# Altium schematic sheet Sheet2.SchDoc
size A4
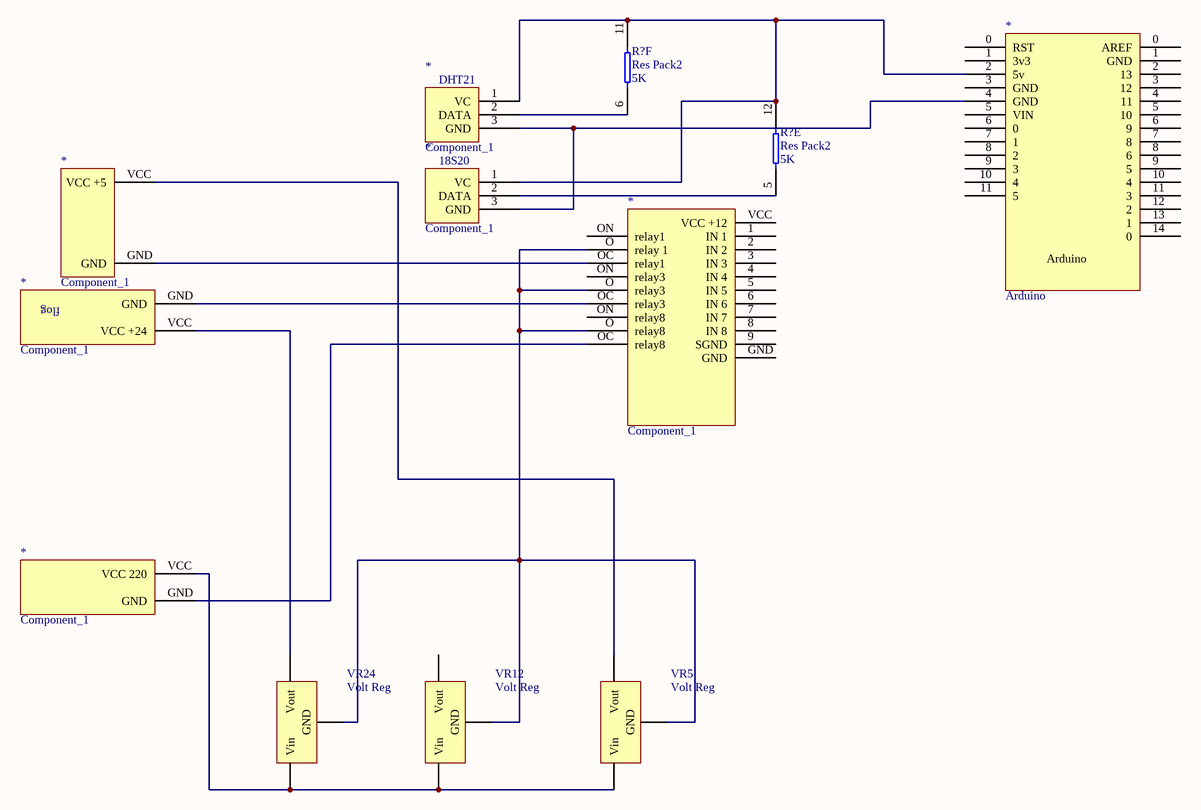
[diagram p0: Sheet2.SchDoc]

## Parts
(Parts that share a designator on the sheet are numbered #1, #2 ... from top to bottom, then left to right.)
*#1  Arduino
*#2  Component_1
*#3  Component_1
*#4  Component_1
*#5  Component_1
*#6  Component_1
*#7  Component_1
R?#1  Res Pack2  value 5K  [DIP-16]  (part F of 8)
R?#2  Res Pack2  value 5K  [DIP-16]  (part E of 8)
VR5  Volt Reg  [D2PAK_N]
VR12  Volt Reg  [D2PAK_N]
VR24  Volt Reg  [D2PAK_N]

## Nets
Net*#1_2: *#1.2(5v) *#2.1(VC) *#7.1(VC) R?#1.11 R?#2.12
Net*#1_4: *#1.4(GND) *#2.3(GND) *#7.3(GND)
Net*#2_2: *#2.2(DATA) R?#2.5
Net*#3_GND: *#3.GND *#5.OC(relay1)
Net*#3_VCC: *#3.VCC(VCC_+5) VR5.3(Vout)
Net*#4_GND: *#4.GND *#5.OC(relay3)
Net*#4_VCC: *#4.VCC(VCC_+24) VR24.3(Vout)
Net*#5_O: *#5.O(relay_1) VR5.2(GND) VR12.2(GND) VR24.2(GND)
Net*#5_OC: *#5.OC(relay8) *#6.GND
Net*#6_VCC: *#6.VCC(VCC_220) VR5.1(Vin) VR12.1(Vin) VR24.1(Vin)
Net*#7_2: *#7.2(DATA) R?#1.6

Not connected (* = marked no-connect by the designer): *#1 0(RST) 1(3v3) 3(GND) 5(VIN) 6(0) 7(1) 8(2) 9(3) 10(4) 11(5) 12(2) 13(1) 14(0); *#5 1(IN_1) 2(IN_2) 3(IN_3) 4(IN_4) 5(IN_5) 6(IN_6) 7(IN_7) 8(IN_8) 9(SGND) GND ON(relay1) VCC(VCC_+12); VR12 3(Vout)

## Notes on the sheet
- (in symbol Component_1) DHT21; 18S20; flog

## Library data of the parts
R?#1 R?#2 = Res Pack2: Isolated Resistor Network - Parts; Sim Note: Enter the Resistance value into parameter field.; Published: 24-Mar-1999; LatestRevisionDate: 17-Jul-2002; LatestRevisionNote: Re-released for DXP Platform.; PackageReference: DIP-16; Publisher: Altium Limited; Code_JEDEC: MO-001-AC
VR5 VR12 VR24 = Volt Reg: Voltage Regulator; Published: 24-Mar-1999; LatestRevisionDate: 29-May-2009; LatestRevisionNote: IPC-7351 Footprint Added.; PackageReference: D2PAK; Publisher: Altium Limited; PackageDescription: 3-Pin Transistor Outline Package 2.54 mm Pitch, 15.1 mm Lead Span